# EAGLE design LPC_2TE_3.8smd (EAGLE 9.6.2)
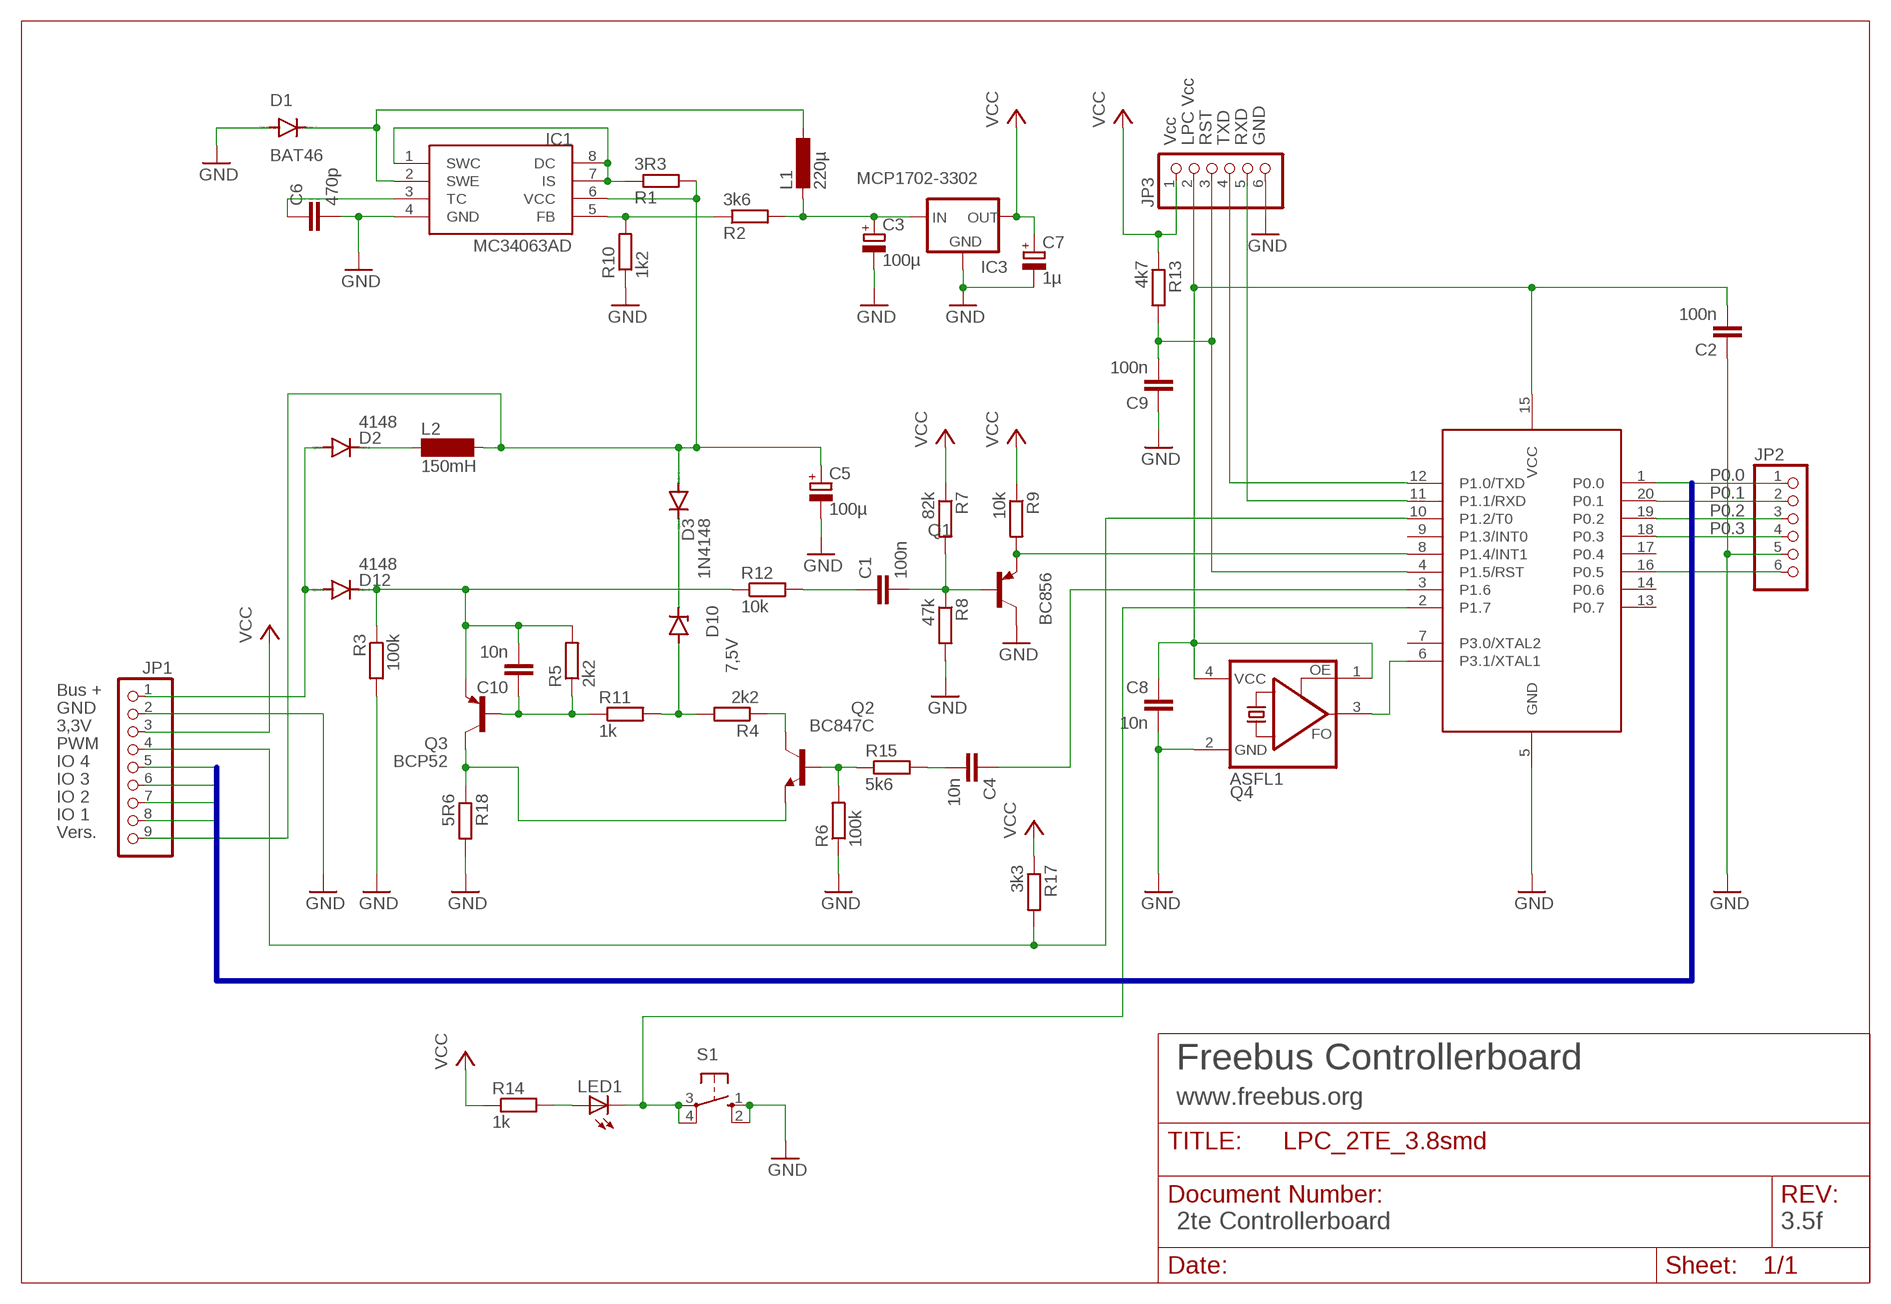
[diagram p0: schematic, sheet 1]

## Parts
89LPC922  89LPC922  [DIL20]
C1  100n  C-EUC1206  [C1206]
C2  100n  C-EUC1206  [C1206]
C3  100µ  CPOL-EUE2.5-6  [E2,5-6]
C4  10n  C-EUC1206  [C1206]
C5  100µ  CPOL-EUE3.5-8  [E3,5-8]
C6  470p  C-EUC1206  [C1206]
C7  1µ  CPOL-EUE2-5  [E2-5]
C8  10n  C-EUC1206  [C1206]
C9  100n  C-EUC1206  [C1206]
C10  10n  C-EUC1206  [C1206]
D1  BAT46  DIODE-MINIMELF  [MINIMELF]
D2  4148  DIODE-MINIMELF  [MINIMELF]
D3  1N4148  DIODE-MINIMELF  [MINIMELF]
D10  7,5V  ZPD  [DO35Z10]
D12  4148  DIODE-MINIMELF  [MINIMELF]
IC1  MC34063AD  [SOIC8]
IC3  MCP1702-3302  79LXX  [79LXX]
JP1  PINHD-1X9_LONG_2.54  [1X09_LONG]
JP2  PINHD-1X6  [1X06]
JP3  PINHD-1X6  [1X06]
L1  220µ  L-EU0207/12  [0207/12]
L2  150mH  BS11  [BS11]
LED1  LED3MM  [LED3MM]
Q1  BC856  BC856BSMD  [SOT23-BEC]
Q2  BC847C  BC847CSMD  [SOT23]
Q3  BCP52  FZT753SMD  [SOT223]
Q4  ASFL1  [ASF]
R1  3R3  R-EU_R1206  [R1206]
R2  3k6  R-EU_R1206  [R1206]
R3  100k  R-EU_R1206  [R1206]
R4  2k2  R-EU_R1206  [R1206]
R5  2k2  R-EU_R1206  [R1206]
R6  100k  R-EU_R1206  [R1206]
R7  82k  R-EU_R1206  [R1206]
R8  47k  R-EU_R1206  [R1206]
R9  10k  R-EU_R1206  [R1206]
R10  1k2  R-EU_R1206  [R1206]
R11  1k  R-EU_R1206  [R1206]
R12  10k  R-EU_R1206  [R1206]
R13  4k7  R-EU_R1206  [R1206]
R14  1k  R-EU_R1206  [R1206]
R15  5k6  R-EU_R1206  [R1206]
R17  3k3  R-EU_R1206  [R1206]
R18  5R6  R-EU_R1206  [R1206]
S1  10-XX  [B3F-10XX]

## Nets
/RESET: 89LPC922.4(P1.5/RST) C9.2 JP3.3 R13.2
BASE: C1.2 Q1.B R7.2 R8.1
BASE_SEND: Q2.1(B) R6.2 R15.1
EIB+: D2.A D12.A JP1.1
EIB_DC: C5.+ D3.A IC1.6(VCC) JP1.9 L2.2 R1.2
FEEDBACK: IC1.5(FB) R2.1 R10.2
GND: 89LPC922.5(GND) C2.1 C3.- C5.- C6.2 C7.- C8.2 C9.1 D1.A IC1.4(GND) IC3.GND JP1.2 JP2.5 JP3.6 Q1.C Q4.2(GND) R3.2 R6.1 R8.2 R10.1 R18.2 S1.1(S) S1.2(S1)
I_SENSE: Q2.2(E) Q3.2(C) Q3.4(C) R18.1
N$1: Q2.3(C) R4.1
N$4: C10.2 D12.C Q3.3(E) R3.1 R5.2 R12.1
N$6: 89LPC922.6(P3.1/XTAL1) Q4.3(FO)
N$8: IC1.1(SWC) IC1.7(IS) IC1.8(DC) R1.1
N$9: LED1.A R14.2
N$13: D2.C L2.1
N$14: C6.1 IC1.3(TC)
N$15: D3.C D10.C
N$16: C1.1 R12.2
N$17: C4.2 R15.2
N$28: C10.1 Q3.1(B) R5.1 R11.1
P0.0: 89LPC922.1(P0.0) JP1.8 JP2.1
P0.1: 89LPC922.20(P0.1) JP1.7 JP2.2
P0.2: 89LPC922.19(P0.2) JP1.6 JP2.3
P0.3: 89LPC922.18(P0.3) JP1.5 JP2.4
P0.5: 89LPC922.16(P0.5) JP2.6
PROG: 89LPC922.2(P1.7) LED1.K(C) S1.3(P) S1.4(P1)
PWM: 89LPC922.10(P1.2/T0) JP1.4 R17.2
REFERENZ: D10.A R4.2 R11.2
RXD: 89LPC922.11(P1.1/RXD) JP3.5
SIGIN: 89LPC922.8(P1.4/INT1) Q1.E R9.2
SIGOUT: 89LPC922.3(P1.6) C4.1
SWITCHED: D1.C IC1.2(SWE) L1.1
TXD: 89LPC922.12(P1.0/TXD) JP3.4
VCC: C7.+ IC3.OUT JP1.3 JP3.1 R7.1 R9.1 R13.1 R14.1 R17.1
VCC_5V: C3.+ IC3.IN L1.2 R2.2
VCC_LPC: 89LPC922.15(VCC) C2.2 C8.1 JP3.2 Q4.1(OE) Q4.4(VCC)
Unconnected: 89LPC922.7(P3.0/XTAL2) 89LPC922.9(P1.3/INT0) 89LPC922.13(P0.7) 89LPC922.14(P0.6) 89LPC922.17(P0.4)

## Buses
P0.[0..3]

## Notes on the sheet
- Vcc | LPC Vcc | RST | TXD | RXD | GND
- Bus +
- GND
- 3,3V
- PWM
- IO 4
- IO 3
- IO 2
- IO 1
- Vers.
- Freebus Controllerboard
- www.freebus.org
- 2te Controllerboard | 3.5f

## Library data of the parts
89LPC922 = MyIC-MCU:89LPC922: NXP 89LPC922 80C51 8-bit microcontroller with two-clock core 8 KB Flash, 256 Byte RAM User Manual <https://www.nxp.com/docs/en/user-guide/UM_P89LPC920_921_922.pdf>
C1 C2 C4 C6 C8-C10 = rcl:C-EU: CAPACITOR, European symbol; SPICEPREFIX: C
C3 C5 C7 = rcl:CPOL-EU: POLARIZED CAPACITOR, European symbol; SPICEPREFIX: C
D1-D3 D12 = diode:DIODE-: DIODE
D10 = diode:ZPD: Z DIODE 500 mW
IC1 = mc34063:MC34063
IC3 = v-reg:79LXX: VOLTAGE REGULATOR
JP1 = pinhead-1:PINHD-1X9_LONG: PIN HEADER
JP2 JP3 = pinhead:PINHD-1X6: PIN HEADER
L1 = rcl:L-EU: INDUCTOR, European symbol; SPICEPREFIX: L
L2 = inductor-neosid:BS: INDUCTOR nominal inductance, magnetically screened; OC_FARNELL: unknown; OC_NEWARK: unknown
LED1 = led:LED: LED OSRAM: - CHIPLED LG R971, LG N971, LY N971, LG Q971, LY Q971, LO R971, LY R971 LH N974, LH R974 LS Q976, LO Q976, LY Q976 LO Q996 - Hyper CHIPLED LW Q18S LB Q993, LB Q99A, LB R99A - SideLED LS A670, LO A670, LY A670, LG A670, LP A670 LB A673, LV A673, LT A673, LW A673 LH A674 LY A675 LS A676, LA A676, LO A676, LY A676, LW A676 LS A679, LY A679, LG A679 - Hyper Micro SIDELED® LS Y876, LA Y876, LO Y876, LY Y876 LT Y87S - SmartLED LW L88C, LW L88S LB L89C, LB L89S, LG L890 LS L89K, LO L89K, LY L89K LS L896, LA L896, LO L896, LY L896 - TOPLED LS T670, LO T670, LY T670, LG T670, LP T670 LSG T670, LSP T670, LSY T670, LOP T670, LYG T670 LG T671, LOG T671, LSG T671 LB T673, LV T673, LT T673, LW T673 LH T674 LS T676, LA T676, LO T676, LY T676, LB T676, LH T676, LSB T676, LW T676 LB T67C, LV T67C, LT T67C, LS T67K, LO T67K, LY T67K, LW E67C LS E67B, LA E67B, LO E67B, LY E67B, LB E67C, LV E67C, LT E67C LW T67C LS T679, LY T679, LG T679 LS T770, LO T770, LY T770, LG T770, LP T770 LB T773, LV T773, LT T773, LW T773 LH T774 LS E675, LA E675, LY E675, LS T675 LS T776, LA T776, LO T776, LY T776, LB T776 LHGB T686 LT T68C, LB T68C - Hyper Mini TOPLED® LB M676 - Mini TOPLED Santana® LG M470 LS M47K, LO M47K, LY M47K Source: http://www.osram.convergy.de - LUMILED® LXK2-PW12-R00, LXK2-PW12-S00, LXK2-PW14-U00, LXK2-PW14-V00 LXK2-PM12-R00, LXK2-PM12-S00, LXK2-PM14-U00 LXK2-PE12-Q00, LXK2-PE12-R00, LXK2-PE12-S00, LXK2-PE14-T00, LXK2-PE14-U00 LXK2-PB12-K00, LXK2-PB12-L00, LXK2-PB12-M00, LXK2-PB14-N00, LXK2-PB14-P00, LXK2-PB14-Q00 LXK2-PR12-L00, LXK2-PR12-M00, LXK2-PR14-Q00, LXK2-PR14-R00 LXK2-PD12-Q00, LXK2-PD12-R00, LXK2-PD12-S00 LXK2-PH12-R00, LXK2-PH12-S00 LXK2-PL12-P00, LXK2-PL12-Q00, LXK2-PL12-R00 Source: www.luxeon.com
Q1 = transistor-pnp:BC856*: PNP Transistror
Q2 = transistor-npn:BC847*: NPN Transistor
Q3 = transistor-pnp:FZT753SMD: PNP Transistor
Q4 = crystal:ASF*: CRYSTAL CLOCK OSCILLATORS 5.0 Vdc or 3.3 Vdc - LOW PROFILE ULTRA MINIATURE CERAMIC SURFACE MOUNT Source: http://www.abracon.com/Oscillators/asf1-L-L1.pdf; MF: Abracon Corporation; MPN: ASFL1-125.000MHZ-EC-T; OC_FARNELL: 1838931; OC_NEWARK: 19M1882
R1-R15 R17 R18 = rcl:R-EU_: RESISTOR, European symbol; SPICEPREFIX: R
S1 = switch-omron:10-XX: OMRON SWITCH

## Board
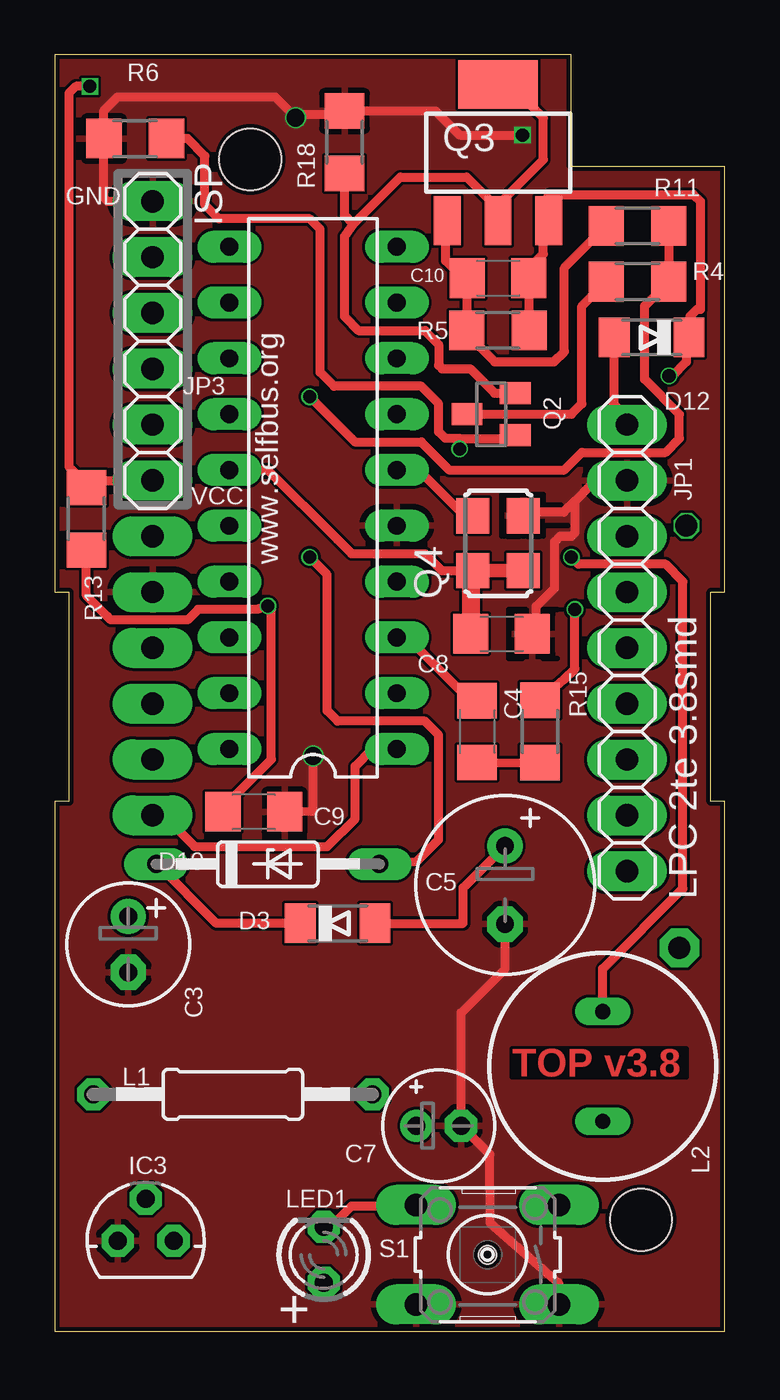
[diagram p1: board, top side]
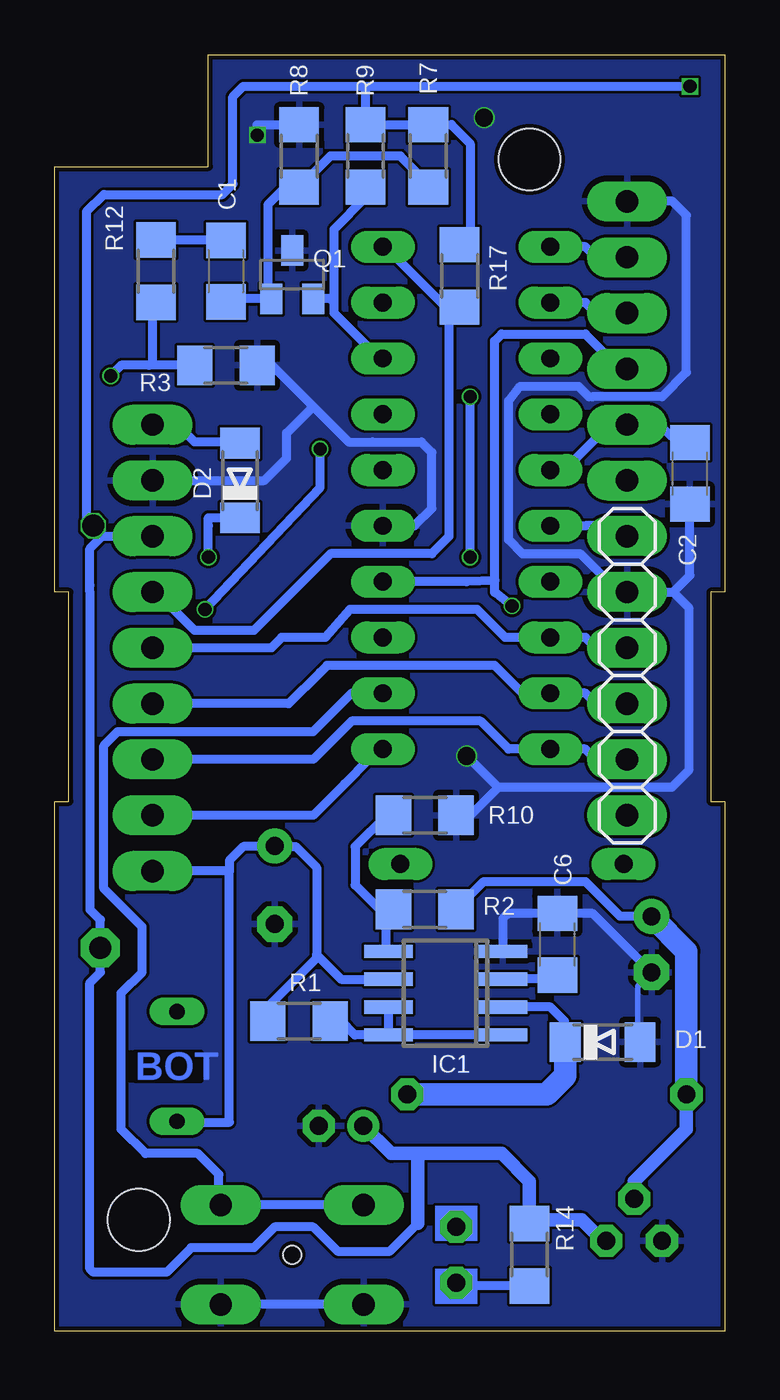
[diagram p2: board, bottom side, seen from below]

Size 30.48 x 58.1 mm. Coordinates in mm from the lower left corner, seen from the top.
Outline: 0,0 30.48,0 30.48,24.13 29.85,24.13 29.85,33.65 30.48,33.65 30.48,53.02 23.5,53.02 23.5,58.1 0,58.1 0,33.65 0.64,33.65 0.64,24.13 0,24.13 0,0
Copper layers (1*16): Top 0.035mm / dielectric 1.6mm / Bottom 0.035mm
Design rules "jlcpcb-2layers": minimum track width 5mil, minimum drill 0.3mm, track to track 5mil, track to pad 5mil, pad to pad 5mil, via to via 5mil, smd to smd 5mil, copper to edge 0.2mm, drill to drill 6mil, minimum pad ring 10mil, minimum via ring 3mil, stop-mask expansion 4mil, vias tented up to drill 0mil, thermal gap 10mil
Holes 2.8 mm at 26.67,5.08 8.89,53.34
Holes 0.8 mm at 19.69,3.49
tRestrict: 12 lines

### Footprints (pad centres in the part's own frame; a part is rotated, then mirrored left to right if it is on the bottom)
DIL20 = drill 0.813 long: 1 -11.43,-3.81; 2 -8.89,-3.81; 3 -6.35,-3.81; 4 -3.81,-3.81; 5 -1.27,-3.81; 6 1.27,-3.81; 7 3.81,-3.81; 8 6.35,-3.81; 9 8.89,-3.81; 10 11.43,-3.81; 11 11.43,3.81; 12 8.89,3.81; 13 6.35,3.81; 14 3.81,3.81; 15 1.27,3.81; 16 -1.27,3.81; 17 -3.81,3.81; 18 -6.35,3.81; 19 -8.89,3.81; 20 -11.43,3.81
C1206 = smd 1.6 x 1.8: 1 -1.4,0; 2 1.4,0
E2,5-6 = drill 0.813 pad 1.6: + -1.27,0 | drill 0.813 pad 1.6 octagon: - 1.27,0
E3,5-8 = drill 0.813 pad 1.6: + -1.778,0 | drill 0.813 pad 1.6 octagon: - 1.778,0
E2-5 = drill 0.813 pad 1.27: + -1.016,0 | drill 0.813 pad 1.27 octagon: - 1.016,0
MINIMELF = smd 1.4 x 1.8: A 1.7,0; C -1.7,0
DO35Z10 = drill 0.813 long: A 5.08,0; C -5.08,0
SOIC8 = smd 0.6 x 2.2: 1 -1.905,-2.6; 2 -0.635,-2.6; 3 0.635,-2.6; 4 1.905,-2.6; 5 1.905,2.6; 6 0.635,2.6; 7 -0.635,2.6; 8 -1.905,2.6
79LXX = drill 0.813 octagon: GND -1.27,0; IN 0,1.905; OUT 1.27,0
1X09_LONG = drill 1.016 long: 1 -10.16,0; 2 -7.62,0; 3 -5.08,0; 4 -2.54,0; 5 0,0; 6 2.54,0; 7 5.08,0; 8 7.62,0; 9 10.16,0
1X06 = drill 1.016 long: 1 -6.35,0; 2 -3.81,0; 3 -1.27,0; 4 1.27,0; 5 3.81,0; 6 6.35,0
0207/12 = drill 0.813 octagon: 1 -6.35,0; 2 6.35,0
BS11 = drill 0.7 long: 1 -2.5,0; 2 2.5,0
LED3MM = drill 0.813 octagon: A -1.27,0; K 1.27,0
SOT23-BEC = smd 1 x 1.4: B -0.95,-1.1; C 0,1.1; E 0.95,-1.1
SOT23 = smd 1 x 1.4: 1 -0.95,-1.1; 2 0.95,-1.1; 3 0,1.1
SOT223 = smd 1.219 x 2.235: 1 -2.311,-3.099; 2 0,-3.099; 3 2.311,-3.099 | smd 3.6 x 2.2: 4 0,3.099
ASF = smd 1.6 x 1.5: 1 -1.25,-1.15; 2 1.25,-1.15; 3 1.25,1.15; 4 -1.25,1.15
R1206 = smd 1.6 x 1.803: 1 -1.422,0; 2 1.422,0
B3F-10XX = drill 1.016 long: 1 -3.251,2.261; 2 3.251,2.261; 3 -3.251,-2.261; 4 3.251,-2.261

### Placement (x,y rotation side)
89LPC922  11.75,37.94 90 top
C1  22.7,48.26 270 bottom
C2  1.59,39.05 90 bottom
C3  3.33,17.62 270 top
C4  19.21,27.3 270 top
C5  20.48,20.32 270 top
C6  7.62,17.62 90 bottom
C7  17.46,9.37 0 top
C8  20.32,31.75 0 top
C9  9.05,23.65 180 top
C10  20.16,47.94 0 top
D1  5.56,13.18 0 bottom
D2  22.07,38.73 90 bottom
D3  12.86,18.57 0 top
D10  9.68,21.27 0 top
D12  27.15,45.24 180 top
IC1  12.7,15.4 90 bottom
IC3  4.13,4.13 0 top
JP1  26.04,31.12 270 top
JP2  4.45,29.84 90 bottom
JP3  4.45,45.08 90 top
L1  8.1,10.79 180 top
L2  24.92,12.06 270 top
LED1  12.22,3.49 90 top
Q1  19.69,48.1 0 bottom
Q2  19.84,41.75 90 top
Q3  20.16,53.66 0 top
Q4  20.16,35.88 90 top
R1  19.37,14.13 180 bottom
R2  13.65,19.21 0 bottom
R3  22.7,43.97 0 bottom
R4  26.51,47.78 0 top
R5  20.16,45.56 0 top
R6  3.65,54.29 0 top
R7  13.49,53.5 270 bottom
R8  19.37,53.5 90 bottom
R9  16.35,53.5 270 bottom
R10  13.65,23.49 180 bottom
R11  26.51,50.32 0 top
R12  25.88,48.26 90 bottom
R13  1.43,36.99 270 top
R14  8.89,3.49 270 bottom
R15  22.07,27.3 270 top
R17  12.07,48.04 270 bottom
R18  13.18,54.13 90 top
S1  19.69,3.49 180 top

### Tracks (layer width: path | path; a pad name or v marks a point on that pad's centre or on a via)
/RESET  (via drill 0.6)
  Top 0.406: 2.38,32.54 2.54,32.38 6.03,32.38 6.51,32.86 9.21,32.86 v9.68,33.02 9.84,32.86 9.84,26.03 7.65,23.84 C9.2 | 2.38,32.54 | 2.38,32.54 1.43,33.5 R13.2
  Bottom 0.406: 89LPC922.4 11.75,34.13 10.47,34.18 | 10.47,34.18 10.48,35.4 10.48,45.08 10.16,45.4 6.35,45.4 4.76,43.81 JP3.3 | v9.68,33.02 10.48,33.65 10.47,34.18
BASE
  Bottom 0.406: R7.2 13.97,52.7 14.76,53.5 17.95,53.5 R8.1 20,52.08 20.8,51.28 20.8,47.16 Q1.B 22.88,47 C1.2
BASE_SEND  (via drill 0.6)
  Top 0.406: R15.1 23.18,29.69 23.65,30.16 v23.65,32.86 | v23.65,32.86 | 18.42,40.64 20.31,40.64 Q2.1 | v18.42,40.16 18.42,40.64 | 18.42,40.64 17.78,40.64 17.46,40.96 17.46,42.23 16.67,43.02 12.7,43.02 12.07,43.66 12.07,50.16 11.59,50.64 7.46,50.64 6.83,51.28 6.83,53.5 6.03,54.29 R6.2
  Bottom 0.406: v23.65,32.86 18.42,38.42 v18.42,40.16
EIB+
  Top 0.406: JP1.1 26.04,41.59 25.4,42.23 25.45,42.27 D12.A
  Bottom 0.406: JP1.1 24.92,41.27 24.13,40.48 22.11,40.48 D2.A
EIB_DC
  Top 0.406: D3.A 18.57,18.57 18.57,20.19 C5.+
  Bottom 0.406: 18.49,17.07 18.57,17.14 18.57,21.11 19.53,22.07 20.45,22.07 C5.+ 20.51,22.07 21.91,22.07 22.54,21.43 22.54,20.95 | 18.49,17.07 17.46,16.03 IC1.6 | R1.2 20.79,14.77 18.49,17.07 | 22.54,20.95 22.54,9.52 24.88,9.52 L2.2 | JP1.9 22.54,20.95
FEEDBACK
  Bottom 0.406: R10.2 15.39,23.49 16.82,22.07 16.82,20.32 15.71,19.21 R2.1 15.07,18.9 15.4,18.57 15.4,17.4 IC1.5
GND  (via drill 0.6, 0.8)
  Top 0.406: v21.27,54.45 18.42,54.45 17.3,55.56 R18.2 13.18,55.4 11.11,55.4 v10.95,55.24 10,56.2 2.86,56.2 2.22,55.56 2.22,53.98 | S1.1 22.94,2.16 19.81,4.92 19.79,8.06 C7.- 18.48,14.51 20.48,16.51 C5.- | v11.75,26.19 11.75,23.68 C9.1 | C5.- | 2.22,53.98 R6.1 | 2.22,53.98 2.22,51.59 2.38,51.43 JP3.6 | 21.33,37.15 21.48,37.29 23.16,37.29 23.67,37.8 | 24.6,38.73 24.36,38.5 | 24.36,38.5 23.67,37.8 | C8.2 21.9,31.92 21.9,33 22.73,33.84 22.73,35.94 22.99,36.19 23.5,36.19 23.67,36.37 23.67,36.81 23.67,37.8 | JP1.2 25.8,38.5 24.36,38.5
  Top 0.61: 21.33,37.15 Q4.2
  Bottom 0.254: D1.A 3.97,13.06 | 3.97,13.06 3.97,13.02 | 3.97,13.06 3.97,15.72 C3.-
  Bottom 0.406: 6.19,42.54 6.67,43.02 9.3,43.02 9.84,42.35 9.84,36.04 9.21,35.4 6.58,35.4 4.83,33.65 JP2.5 2.35,33.65 | S1.2 S1.1 | 6.03,42.54 2.86,42.54 1.75,43.66 1.75,50.8 2.38,51.43 JP3.6 | 18.73,42.1 17.11,40.48 16.03,40.48 13.81,40.48 13.34,40 13.34,37.46 14.13,36.67 89LPC922.5 | 18.73,42.1 19.94,40.89 19.94,39.75 20.96,38.73 JP1.2 | 18.73,42.1 20.66,44.03 21.23,44.03 R3.2 | R8.2 21.28,54.92 v21.27,54.45 | IC1.4 10.1,18.79 9.84,19.05 7.65,19.05 C6.2 6,19.02 C3.- | C2.1 1.59,34.42 2.35,33.65 | 2.35,33.65 1.65,32.96 1.65,25.53 2.41,24.76 10.32,24.76 | 10.32,24.76 v11.75,26.19 | 10.32,24.76 11.59,23.49 R10.1 | JP1.2
  pour Bottom: 0,58.1 23.5,58.1 23.5,53.02 30.48,53.02 30.48,33.65 29.85,33.65 29.85,24.13 30.48,24.13 30.48,0 0,0 0,24.13 0.64,24.13 0.64,33.65 0,33.65
  pour Top: 0,58.1 23.5,58.1 23.5,53.02 30.48,53.02 30.48,33.65 29.85,33.65 29.85,24.13 30.48,24.13 30.48,0 0,0 0,24.13 0.64,24.13 0.64,33.65 0,33.65
I_SENSE
  Top 0.406: 13.57,50.4 13.18,49.85 13.18,46.2 13.81,45.56 16.83,45.56 17.46,44.93 17.46,43.97 17.62,43.81 18.89,43.81 20,42.7 Q2.2 | 13.57,50.4 15.72,52.55 18.73,52.55 19.96,51.32 Q3.2 20.16,51.28 22.23,53.34 22.23,55.24 20.71,56.76 Q3.4 | R18.1 13.18,50.8 13.57,50.4
N$1
  Top 0.406: Q2.3 23.5,41.75 23.97,42.23 23.97,46.66 R4.1
N$4  (via drill 0.6)
  Top 0.406: R5.2 21.58,47.92 C10.2 21.56,48.39 22.23,49.05 22.23,50.31 Q3.3 22.38,50.65 22.38,51.59 22.54,51.75 29.05,51.75 29.37,51.43 29.37,46.51 29.21,46.51 28.89,46.2 28.89,45.29 D12.C 28.73,45.13 28.73,44.13 28.1,43.5 v27.94,43.5
  Bottom 0.406: R3.1 26.19,43.97 | 26.19,43.97 26.04,44.13 26.04,46.68 R12.1 | 26.19,43.97 27.46,43.97 v27.94,43.5
N$6
  Top 0.406: Q4.3 18.63,37.13 16.54,39.21 89LPC922.6
N$8
  Bottom 0.406: IC1.8 IC1.7 | IC1.1 IC1.8 | R1.1 17.46,14.13 16.83,13.49 IC1.8
N$9
  Bottom 0.406: R14.2 12.07,2.07 LED1.A
N$13  (via drill 0.6)
  Top 0.406: L2.1 24.92,14.72 24.92,15.56 24.92,16.51 28.58,20.16 28.58,34.13 27.78,34.92 23.81,34.92 v23.5,35.24
  Bottom 0.406: v23.5,35.24 23.5,36.67 23.5,37.03 D2.C
N$14
  Bottom 0.406: C6.1 7.78,16.06 10.07,16.06 IC1.3
N$15
  Top 0.406: D3.C 7.35,18.57 4.63,21.29 D10.C
N$16
  Bottom 0.406: C1.1 25.85,49.66 R12.2
N$17
  Top 0.406: C4.2 R15.2
N$28
  Top 0.406: Q3.1 17.78,50.49 17.78,48.74 18.57,47.94 C10.1 18.74,47.92 R5.1 18.74,45.4 20,44.13 22.7,44.13 23.18,44.61 23.18,48.41 R11.1
P0.0
  Top 0.406: JP2.1 4.92,23.49 6.35,22.07 12.38,22.07 13.65,23.34 13.65,25.72 | JP2.1 | 13.65,25.72 | 13.65,25.72 14.45,26.51 14.92,26.51 | 89LPC922.1 14.92,26.51 | 14.92,26.51
  Bottom 0.406: 89LPC922.1 15.72,26.51 16.19,26.03 17.3,24.92 18.73,23.49 JP1.8 | JP1.8
P0.1
  Bottom 0.406: JP2.2 5.87,26.03 6.35,26.51 89LPC922.20 7.78,26.51 | JP1.7 24.61,26.03 23.5,26.03 18.73,26.03 16.99,27.78 11.11,27.78 9.84,26.51 7.78,26.51 | 7.78,26.51
P0.2
  Bottom 0.406: JP2.3 5.87,28.57 6.35,29.05 89LPC922.19 7.62,29.05 | 25.08,28.57 JP1.6 | 7.62,29.05 | 7.62,29.05 9.21,29.05 10.48,30.32 17.46,30.32 18.1,30.32 | 18.1,30.32 | 18.1,30.32 18.42,30 19.84,28.57 25.08,28.57 | 25.08,28.57
P0.3
  Bottom 0.406: 23.34,31.11 JP1.5 | JP2.4 5.87,31.11 6.35,31.59 89LPC922.18 10,31.59 11.27,32.86 17.07,32.86 18.18,31.59 19.05,31.59 20.16,31.59 20.64,31.11 23.34,31.11 | 23.34,31.11
P0.5
  Bottom 0.406: 6.35,36.67 4.92,36.67 JP2.6 | 89LPC922.16 6.35,36.67 | 6.35,36.67 | JP2.6 | JP2.6
PROG
  Top 0.406: LED1.K 12.54,4.76 13.49,5.71 16.19,5.71 16.23,5.75 S1.4
  Bottom 0.406: 24.45,27.3 27.62,27.3 28.26,26.67 28.26,20.16 26.51,18.41 26.51,16.35 27.46,15.4 27.46,9.21 26.35,8.1 23.97,8.1 23.02,7.14 | S1.4 S1.3 23.02,5.75 23.02,7.14 | 24.45,27.3 | 24.45,27.3 18.73,27.3 16.99,29.05 15.72,29.05 89LPC922.2 | 23.02,7.14
PWM
  Bottom 0.406: 89LPC922.10 15.46,49.37 12.7,46.62 R17.2 12.57,46.62 12.54,46.5 12.54,36.19 13.34,35.4 17.94,35.4 21.43,31.91 24.13,31.91 25.88,33.65 JP1.4
REFERENZ  (via drill 0.6)
  Top 0.406: v11.59,42.54 13.65,40.48 16.67,40.48 17.94,39.21 23.18,39.21 23.97,40 27.78,40 28.42,40.64 28.42,41.75 26.83,43.34 26.83,46.68 R4.2 R11.2 | v11.59,35.24 12.38,34.45 12.38,28.26 12.86,27.78 16.83,27.78 17.46,27.15 17.46,22.38 16.46,21.38 D10.A | v11.59,35.24 | v11.59,35.24
  Bottom 0.406: v11.59,42.54 11.59,37.31 v11.59,35.24
RXD
  Bottom 0.406: JP3.5 5.87,48.89 6.35,49.37 89LPC922.11
SIGIN
  Bottom 0.406: 89LPC922.8 15.72,44.29 | 15.72,44.29 | 15.72,44.29 17.78,46.35 17.78,46.83 | 17.78,46.83 17.78,50.16 16.35,51.59 R9.2 | Q1.E 17.95,47 17.78,46.83
SIGOUT
  Top 0.406: 89LPC922.3 16.03,31.59 18.92,28.7 C4.1
SWITCHED
  Bottom 0.406: IC1.2 7.94,14.76 7.3,14.13 7.3,13.22 D1.C
  Bottom 1.016: D1.C 7.26,11.63 8.1,10.79 L1.1 | L1.1
TXD
  Bottom 0.406: JP3.4 5.87,46.35 6.35,46.83 89LPC922.12
VCC  (via drill 0.6, 1, 1 pad 1.78)
  Top 0.406: 1.43,38.73 1.27,38.73 0.64,39.37 0.64,56.36 0.95,56.67 v1.59,56.67 | 1.43,38.73 JP3.1 | JP3.1 | 1.43,38.73 R13.1
  Bottom 0.406: 13.97,4.92 15.24,3.65 17.62,3.65 18.73,4.76 20.48,4.76 21.43,3.81 24.29,3.81 25.4,2.7 28.73,2.7 28.89,2.86 28.89,15.87 28.42,16.35 v28.42,17.46 28.42,18.26 28.42,18.73 28.89,19.21 28.89,33.65 28.89,33.97 28.89,35.62 28.32,36.19 28.26,36.19 | 28.26,36.19 v28.73,36.67 29.05,36.99 29.05,50.96 28.26,51.75 22.86,51.75 22.38,52.23 22.38,56.2 21.91,56.67 16.35,56.67 | 28.26,36.19 JP1.3 | 16.35,56.67 R9.1 15.56,54.92 R7.1 12.45,54.93 11.59,54.07 11.59,49.94 R17.1 | v1.59,56.67 11.75,56.67 12.22,56.67 15.88,56.67 16.35,56.67
  Bottom 0.61: 13.97,8.1 10.16,8.1 8.89,6.83 8.89,5.08 | 13.97,8.1 15.18,8.1 C7.+ | 13.97,8.1 13.97,4.92 | 8.89,5.08 6.51,5.08 5.56,4.13 IC3.OUT | 8.89,5.08 R14.1
VCC_5V
  Bottom 0.406: R2.2 10.96,20.48 6.35,20.48 4.76,18.89 C3.+
  Bottom 0.61: L1.2 1.75,9.21 4.13,6.83 IC3.IN | L1.2
  Bottom 1.016: L1.2 | L1.2 1.75,17.3 C3.+
VCC_LPC
  Top 0.406: Q4.4 17.6,34.63 16.83,35.4 13.49,35.4 12.86,36.04 | 12.86,36.04 | 12.86,36.04 9.68,39.21 89LPC922.15
  Top 0.61: Q4.4 Q4.1
  Top 0.813: C8.1 18.92,34.54 Q4.4
  Bottom 0.406: JP3.2 5.24,41.27 7.3,39.21 89LPC922.15 | JP3.2 | JP3.2 3.02,41.27 1.75,40.13 1.75,40.29 C2.2
(copper drawn outside any net)
  shapes: Bottom area x2

### Text on the board
Top: TOP v3.8
Bottom: BOT
tPlace: +
tNames: GND | ISP | VCC | www.selfbus.org | LPC 2te 3.8smd